# EAGLE schematic Amplificador_Push_Pull_AB (EAGLE 7.6.0)
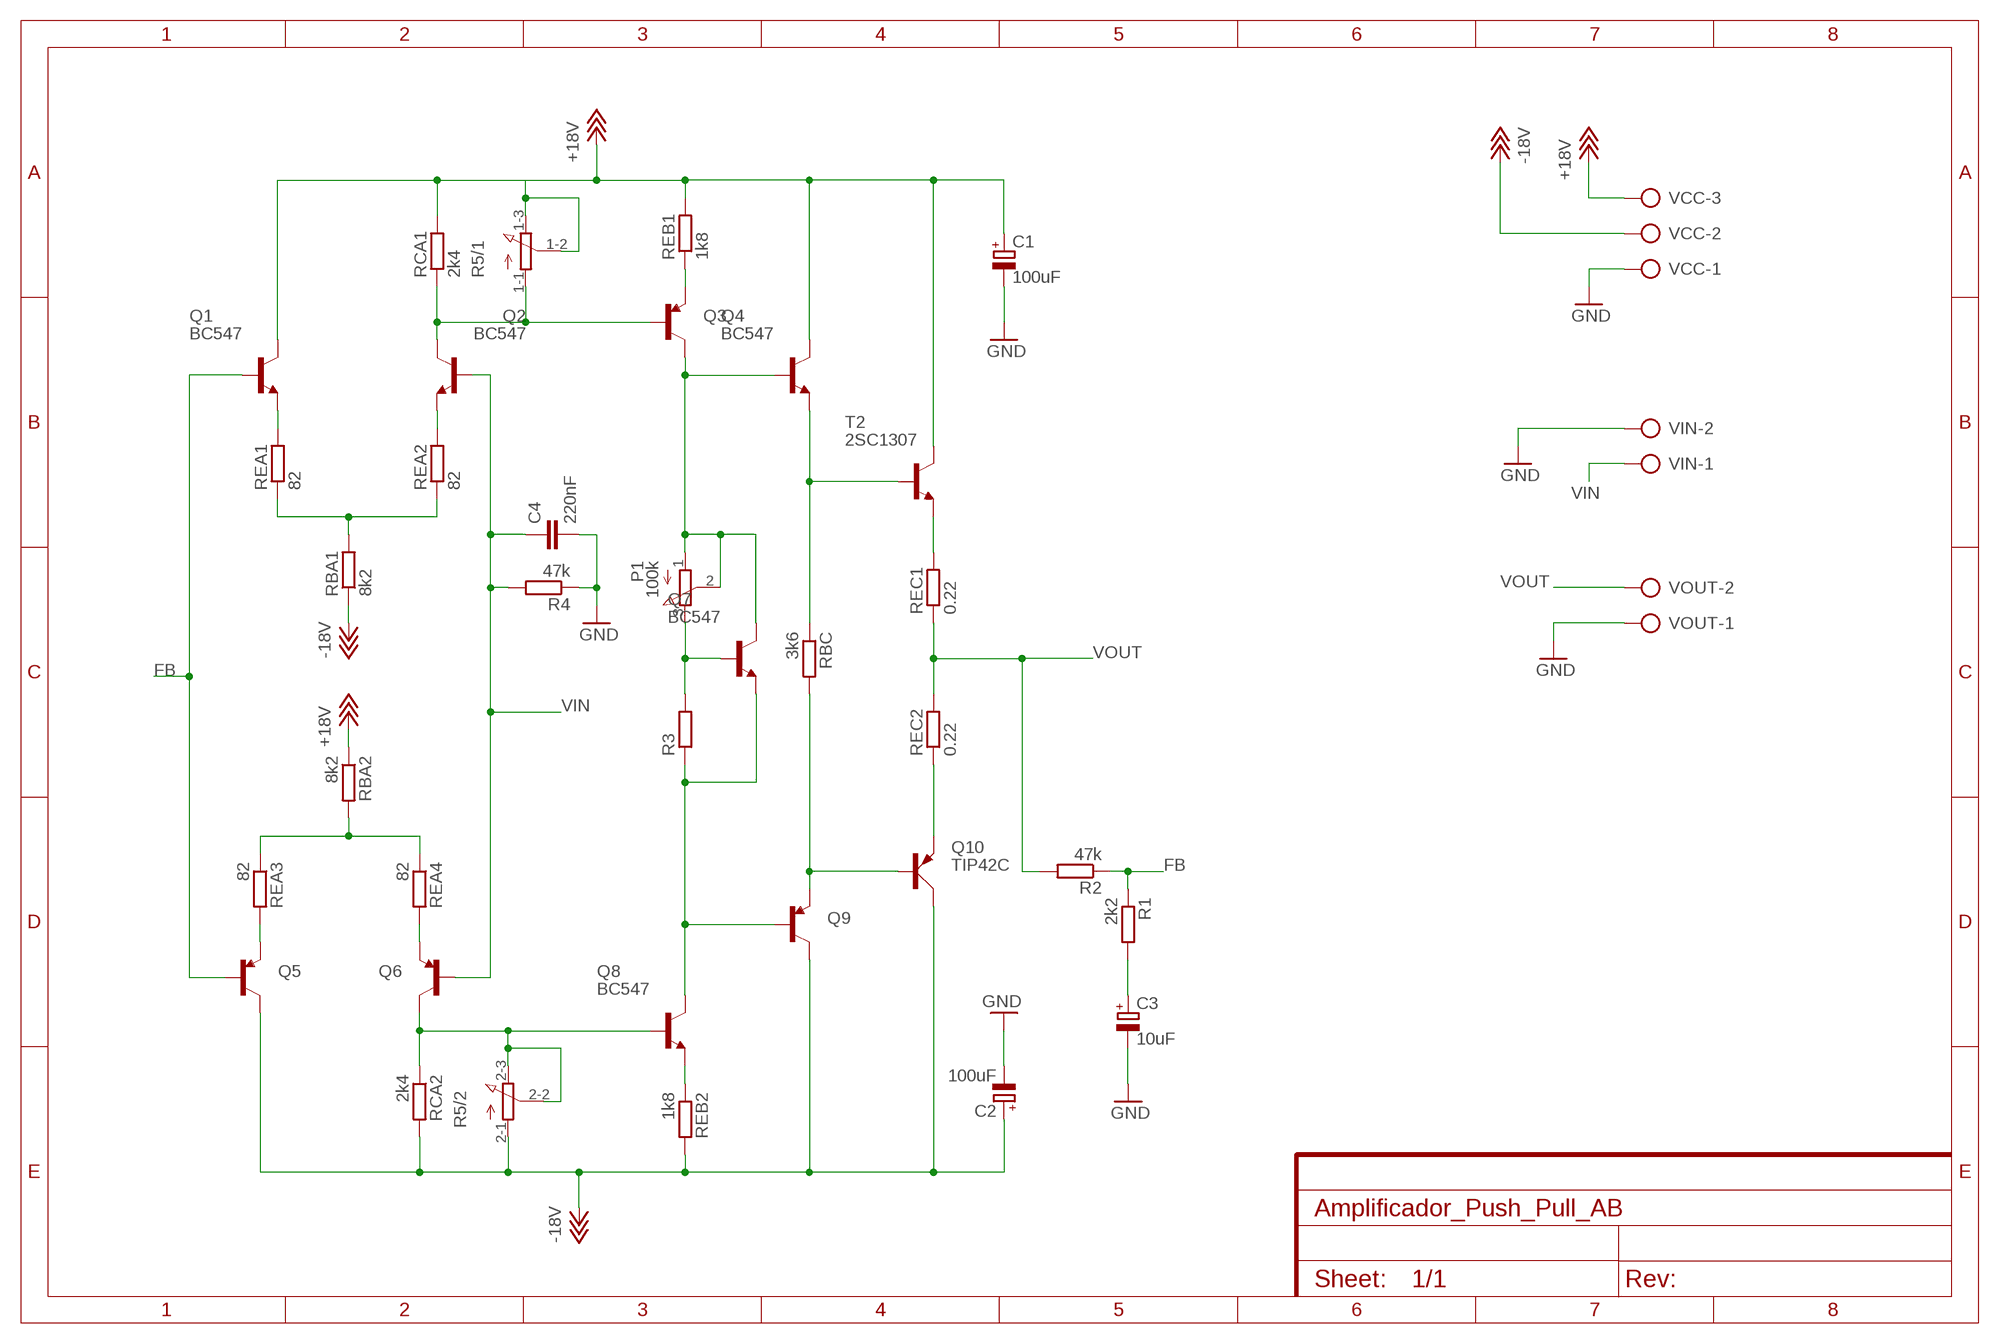
[diagram p0: schematic, sheet 1]

## Parts
C1  100uF  CPOL-EUE2.5-6  [E2,5-6]
C2  100uF  CPOL-EUE2.5-6  [E2,5-6]
C3  10uF  CPOL-EUE2.5-5  [E2,5-5]
C4  220nF  C-EU025-025X050  [C025-025X050]
P1  100k  3RP/1610N  [3RP/1610N]
Q1  BC547  [TO92]
Q2  BC547  [TO92]
Q3  TRANSISTOR_PNPTO92  [TO-92]
Q4  BC547  [TO92]
Q5  TRANSISTOR_PNPTO92  [TO-92]
Q6  TRANSISTOR_PNPTO92  [TO-92]
Q7  BC547  [TO92]
Q8  BC547  [TO92]
Q9  TRANSISTOR_PNPTO92  [TO-92]
Q10  TIP42C  [TO220AV]
R1  2k2  R-EU_0207/10  [0207/10]
R2  47k  R-EU_0207/10  [0207/10]
R3  R-EU_0207/10  [0207/10]
R4  47k  R-EU_0207/10  [0207/10]
R5  3RP/1610G  [3RP/1610G]
RBA1  8k2  R-EU_0207/10  [0207/10]
RBA2  8k2  R-EU_0207/10  [0207/10]
RBC  3k6  R-EU_0207/10  [0207/10]
RCA1  2k4  R-EU_0207/10  [0207/10]
RCA2  2k4  R-EU_0207/10  [0207/10]
REA1  82  R-EU_0207/10  [0207/10]
REA2  82  R-EU_0207/10  [0207/10]
REA3  82  R-EU_0207/10  [0207/10]
REA4  82  R-EU_0207/10  [0207/10]
REB1  1k8  R-EU_0207/10  [0207/10]
REB2  1k8  R-EU_0207/10  [0207/10]
REC1  0.22  R-EU_0617/22  [0617/22]
REC2  0.22  R-EU_0617/22  [0617/22]
T2  2SC1307  [TO220AV]
VCC  AK500/3-H  [AK500/3-H]
VIN  AK500/2-H  [AK500/2-H]
VOUT  AK500/2-H  [AK500/2-H]

## Nets
+18V: C1.+ Q1.3(C) Q4.3(C) R5.1-2(/1:S) R5.1-3(/1:E) RBA2.1 RCA1.2 REB1.2 T2.2(C) VCC.3
-18V: C2.+ Q5.1(C) Q9.1(C) Q10.C R5.2-1(/2:A) RBA1.1 RCA2.2 REB2.2 VCC.2
FB: Q1.2(B) Q5.2(B) R1.1 R2.1
GND: C1.- C2.- C3.- C4.2 R4.1 VCC.1 VIN.2 VOUT.1
N$1: Q1.1(E) REA1.2
N$2: RBA1.2 REA1.1 REA2.1
N$3: RBA2.2 REA3.1 REA4.1
N$4: Q2.1(E) REA2.2
N$5: Q2.3(C) Q3.2(B) R5.1-1(/1:A) RCA1.1
N$6: Q6.3(E) REA4.2
N$7: Q5.3(E) REA3.2
N$8: Q6.1(C) Q8.2(B) R5.2-2(/2:S) R5.2-3(/2:E) RCA2.1
N$10: Q3.3(E) REB1.1
N$11: P1.1(A) P1.2(S) Q3.1(C) Q4.2(B) Q7.3(C)
N$13: Q4.1(E) RBC.1 T2.1(B)
N$15: Q7.1(E) Q8.3(C) Q9.2(B) R3.1
N$16: Q8.1(E) REB2.1
N$17: Q9.3(E) Q10.B RBC.2
N$19: REC1.2 T2.3(E)
N$21: Q10.E REC2.1
N$23: C3.+ R1.2
P1: P1.3(E) Q7.2(B) R3.2
VIN: C4.1 Q2.2(B) Q6.2(B) R4.2 VIN.1
VOUT: R2.2 REC1.1 REC2.2 VOUT.2

## Library data of the parts
C1-C3 = rcl:CPOL-EU: POLARIZED CAPACITOR, European symbol
C4 = rcl:C-EU: CAPACITOR, European symbol
P1 = pot:3RP/1610N: 16mm Potentiometer one level Source: http://www.alphapotentiometers.net/html/16mm_pot_2.html
Q1 Q2 Q4 Q7 Q8 = transistor:BC547: NPN TRANSISTOR
Q3 Q5 Q6 Q9 = SparkFun-DiscreteSemi:TRANSISTOR_PNP: Generic PNP BJT Double check pinouts against datasheets- not all devices are the same! MMBT3906 - 40V 200mA SOT-23 (TRANS-08052) MMBT4403 - 40V 600mA SOT-23 (TRANS-09245)
Q10 = transistor-power:TIP42C: PNP TRANSISTOR
R1-R4 RBA1 RBA2 RBC RCA1 RCA2 REA1-REA4 REB1 REB2 REC1 REC2 = rcl:R-EU_: RESISTOR, European symbol
R5 = pot:3RP/1610G: 16mm Potentiometer two level Source: http://www.alphapotentiometers.net/html/16mm_pot_2.html
T2 = transistor-neu-to92:2SC1307: NPN Transistor Silicon Epitaxial, High Frequency Power Amplifier Source: 2SC1307.pdf
VCC = con-ptr500:AK500/3-H: CONNECTOR Aug. 2004 / PTR Meßtechnik: Die Bezeichnung der Serie AK505 wurde geändert. Es handelt sich hierbei um AK500 in horizontaler Ausführung.; OC_FARNELL: unknown; OC_NEWARK: unknown
VIN VOUT = con-ptr500:AK500/2-H: CONNECTOR Aug. 2004 / PTR Meßtechnik: Die Bezeichnung der Serie AK505 wurde geändert. Es handelt sich hierbei um AK500 in horizontaler Ausführung.; OC_FARNELL: unknown; OC_NEWARK: unknown